# EAGLE design Top (EAGLE 9.6.2)
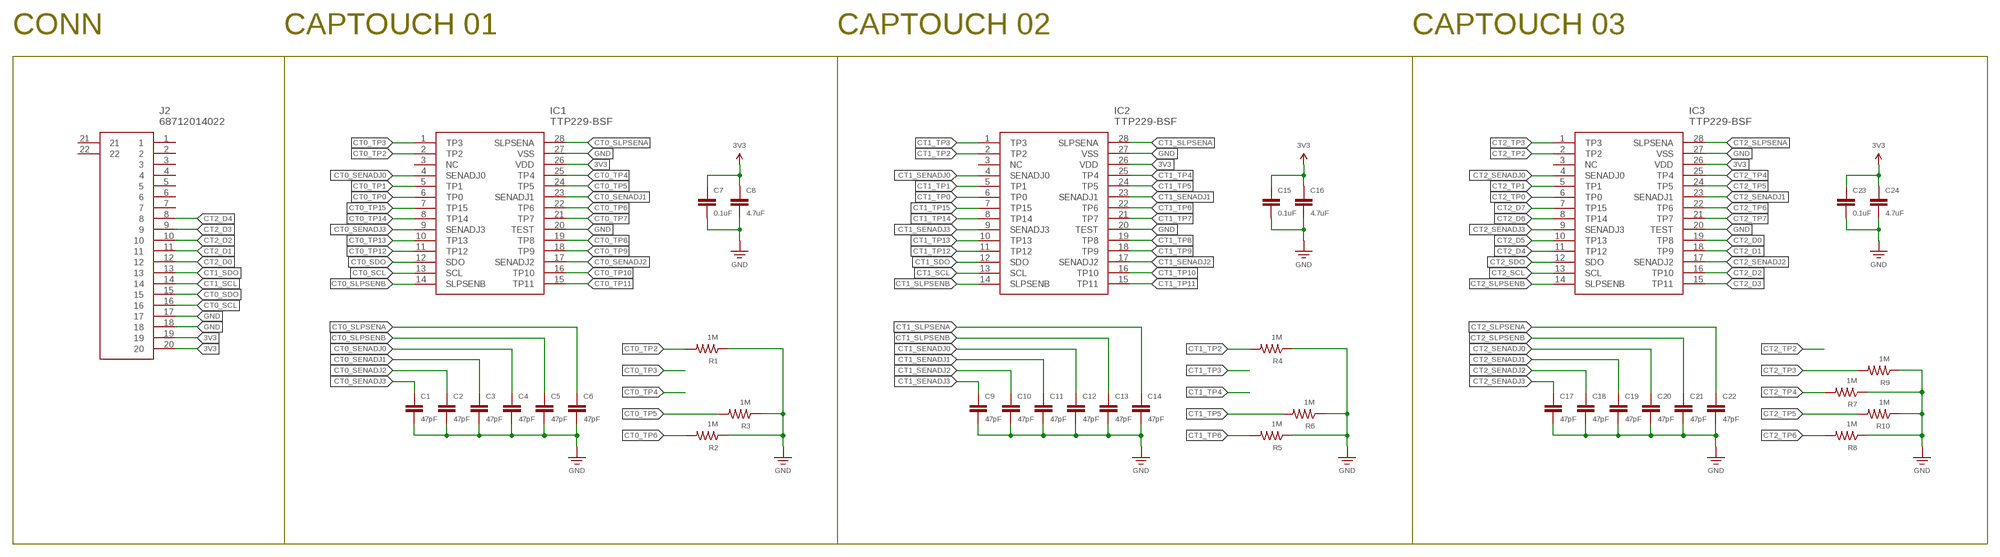
[diagram p0: schematic, sheet 1]

## Parts
C1  47pF  CAP-0603  [CAP-0603]
C2  47pF  CAP-0603  [CAP-0603]
C3  47pF  CAP-0603  [CAP-0603]
C4  47pF  CAP-0603  [CAP-0603]
C5  47pF  CAP-0603  [CAP-0603]
C6  47pF  CAP-0603  [CAP-0603]
C7  0.1uF  CAP-0603  [CAP-0603]
C8  4.7uF  CAP-0603  [CAP-0603]
C9  47pF  CAP-0603  [CAP-0603]
C10  47pF  CAP-0603  [CAP-0603]
C11  47pF  CAP-0603  [CAP-0603]
C12  47pF  CAP-0603  [CAP-0603]
C13  47pF  CAP-0603  [CAP-0603]
C14  47pF  CAP-0603  [CAP-0603]
C15  0.1uF  CAP-0603  [CAP-0603]
C16  4.7uF  CAP-0603  [CAP-0603]
C17  47pF  CAP-0603  [CAP-0603]
C18  47pF  CAP-0603  [CAP-0603]
C19  47pF  CAP-0603  [CAP-0603]
C20  47pF  CAP-0603  [CAP-0603]
C21  47pF  CAP-0603  [CAP-0603]
C22  47pF  CAP-0603  [CAP-0603]
C23  0.1uF  CAP-0603  [CAP-0603]
C24  4.7uF  CAP-0603  [CAP-0603]
IC1  TTP229-BSF  [SOP64P600X175-28N]
IC2  TTP229-BSF  [SOP64P600X175-28N]
IC3  TTP229-BSF  [SOP64P600X175-28N]
J2  68712014022  [68712014022]
R1  1M  RES-0603  [RES-0603]
R2  1M  RES-0603  [RES-0603]
R3  1M  RES-0603  [RES-0603]
R4  1M  RES-0603  [RES-0603]
R5  1M  RES-0603  [RES-0603]
R6  1M  RES-0603  [RES-0603]
R7  1M  RES-0603  [RES-0603]
R8  1M  RES-0603  [RES-0603]
R9  1M  RES-0603  [RES-0603]
R10  1M  RES-0603  [RES-0603]

## Nets
3V3: C7.P$1 C8.P$1 C15.P$1 C16.P$1 C23.P$1 C24.P$1 IC1.26(VDD) IC2.26(VDD) IC3.26(VDD) J2.19 J2.20
CT0_SCL: IC1.13(SCL) J2.16
CT0_SDO: IC1.12(SDO) J2.15
CT0_SENADJ0: C4.P$1 IC1.4(SENADJ0)
CT0_SENADJ1: C3.P$1 IC1.23(SENADJ1)
CT0_SENADJ2: C2.P$1 IC1.17(SENADJ2)
CT0_SENADJ3: C1.P$1 IC1.9(SENADJ3)
CT0_SLPSENA: C6.P$1 IC1.28(SLPSENA)
CT0_SLPSENB: C5.P$1 IC1.14(SLPSENB)
CT0_TP0: IC1.6(TP0)
CT0_TP1: IC1.5(TP1)
CT0_TP2: IC1.2(TP2) R1.P$2
CT0_TP3: IC1.1(TP3)
CT0_TP4: IC1.25(TP4)
CT0_TP5: IC1.24(TP5) R3.P$2
CT0_TP6: IC1.22(TP6) R2.P$2
CT0_TP7: IC1.21(TP7)
CT0_TP8: IC1.19(TP8)
CT0_TP9: IC1.18(TP9)
CT0_TP10: IC1.16(TP10)
CT0_TP11: IC1.15(TP11)
CT0_TP12: IC1.11(TP12)
CT0_TP13: IC1.10(TP13)
CT0_TP14: IC1.8(TP14)
CT0_TP15: IC1.7(TP15)
CT1_SCL: IC2.13(SCL) J2.14
CT1_SDO: IC2.12(SDO) J2.13
CT1_SENADJ0: C12.P$1 IC2.4(SENADJ0)
CT1_SENADJ1: C11.P$1 IC2.23(SENADJ1)
CT1_SENADJ2: C10.P$1 IC2.17(SENADJ2)
CT1_SENADJ3: C9.P$1 IC2.9(SENADJ3)
CT1_SLPSENA: C14.P$1 IC2.28(SLPSENA)
CT1_SLPSENB: C13.P$1 IC2.14(SLPSENB)
CT1_TP0: IC2.6(TP0)
CT1_TP1: IC2.5(TP1)
CT1_TP2: IC2.2(TP2) R4.P$2
CT1_TP3: IC2.1(TP3)
CT1_TP4: IC2.25(TP4)
CT1_TP5: IC2.24(TP5) R6.P$2
CT1_TP6: IC2.22(TP6) R5.P$2
CT1_TP7: IC2.21(TP7)
CT1_TP8: IC2.19(TP8)
CT1_TP9: IC2.18(TP9)
CT1_TP10: IC2.16(TP10)
CT1_TP11: IC2.15(TP11)
CT1_TP12: IC2.11(TP12)
CT1_TP13: IC2.10(TP13)
CT1_TP14: IC2.8(TP14)
CT1_TP15: IC2.7(TP15)
CT2_D0: IC3.19(TP8) J2.12
CT2_D1: IC3.18(TP9) J2.11
CT2_D2: IC3.16(TP10) J2.10
CT2_D3: IC3.15(TP11) J2.9
CT2_D4: IC3.11(TP12) J2.8
CT2_D5: IC3.10(TP13)
CT2_D6: IC3.8(TP14)
CT2_D7: IC3.7(TP15)
CT2_SCL: IC3.13(SCL)
CT2_SDO: IC3.12(SDO)
CT2_SENADJ0: C20.P$1 IC3.4(SENADJ0)
CT2_SENADJ1: C19.P$1 IC3.23(SENADJ1)
CT2_SENADJ2: C18.P$1 IC3.17(SENADJ2)
CT2_SENADJ3: C17.P$1 IC3.9(SENADJ3)
CT2_SLPSENA: C22.P$1 IC3.28(SLPSENA)
CT2_SLPSENB: C21.P$1 IC3.14(SLPSENB)
CT2_TP0: IC3.6(TP0)
CT2_TP1: IC3.5(TP1)
CT2_TP2: IC3.2(TP2)
CT2_TP3: IC3.1(TP3) R9.P$2
CT2_TP4: IC3.25(TP4) R7.P$2
CT2_TP5: IC3.24(TP5) R10.P$2
CT2_TP6: IC3.22(TP6) R8.P$2
CT2_TP7: IC3.21(TP7)
GND: C1.P$2 C2.P$2 C3.P$2 C4.P$2 C5.P$2 C6.P$2 C7.P$2 C8.P$2 C9.P$2 C10.P$2 C11.P$2 C12.P$2 C13.P$2 C14.P$2 C15.P$2 C16.P$2 C17.P$2 C18.P$2 C19.P$2 C20.P$2 C21.P$2 C22.P$2 C23.P$2 C24.P$2 IC1.20(TEST) IC1.27(VSS) IC2.20(TEST) IC2.27(VSS) IC3.20(TEST) IC3.27(VSS) J2.17 J2.18 R1.P$1 R2.P$1 R3.P$1 R4.P$1 R5.P$1 R6.P$1 R7.P$1 R8.P$1 R9.P$1 R10.P$1
Unconnected: IC1.3(NC) IC2.3(NC) IC3.3(NC) J2.1 J2.2 J2.3 J2.4 J2.5 J2.6 J2.7 J2.21 J2.22

## Notes on the sheet
- CONN | CAPTOUCH 01 | CAPTOUCH 02 | CAPTOUCH 03

## Library data of the parts
C1-C24 = Capacitor:CAP-0603
IC1-IC3 = RandomWaves:TTP229-BSF: TOUCH PAD DETECTOR IC Source: Datasheet <http://www.tontek.com.tw/download.asp?sn=726>; DESCRIPTION: TOUCH PAD DETECTOR IC; HEIGHT: 1.75mm; MANUFACTURER_NAME: TONTEK; MANUFACTURER_PART_NUMBER: TTP229-BSF
J2 = RandomWaves:68712014022: Wurth Elektronik 687 Series 0.5mm 20 Way 1 Row Straight PCB Socket Surface Mount Wire to Board Source: Datasheet <https://katalog.we-online.de/em/datasheet/6871xx14022.pdf>; DESCRIPTION: Wurth Elektronik 687 Series 0.5mm 20 Way 1 Row Straight PCB Socket Surface Mount Wire to Board; HEIGHT: 2.1mm; MANUFACTURER_NAME: Wurth Elektronik; MANUFACTURER_PART_NUMBER: 68712014022; MOUSER_PART_NUMBER: 710-68712014022; MOUSER_PRICE-STOCK: https://www.mouser.co.uk/ProductDetail/Wurth-Elektronik/68712014022?qs=ZtY9WdtwX57%2F0bEhtjzEjA%3D%3D
R1-R10 = Resistor:RES-0603

## Board
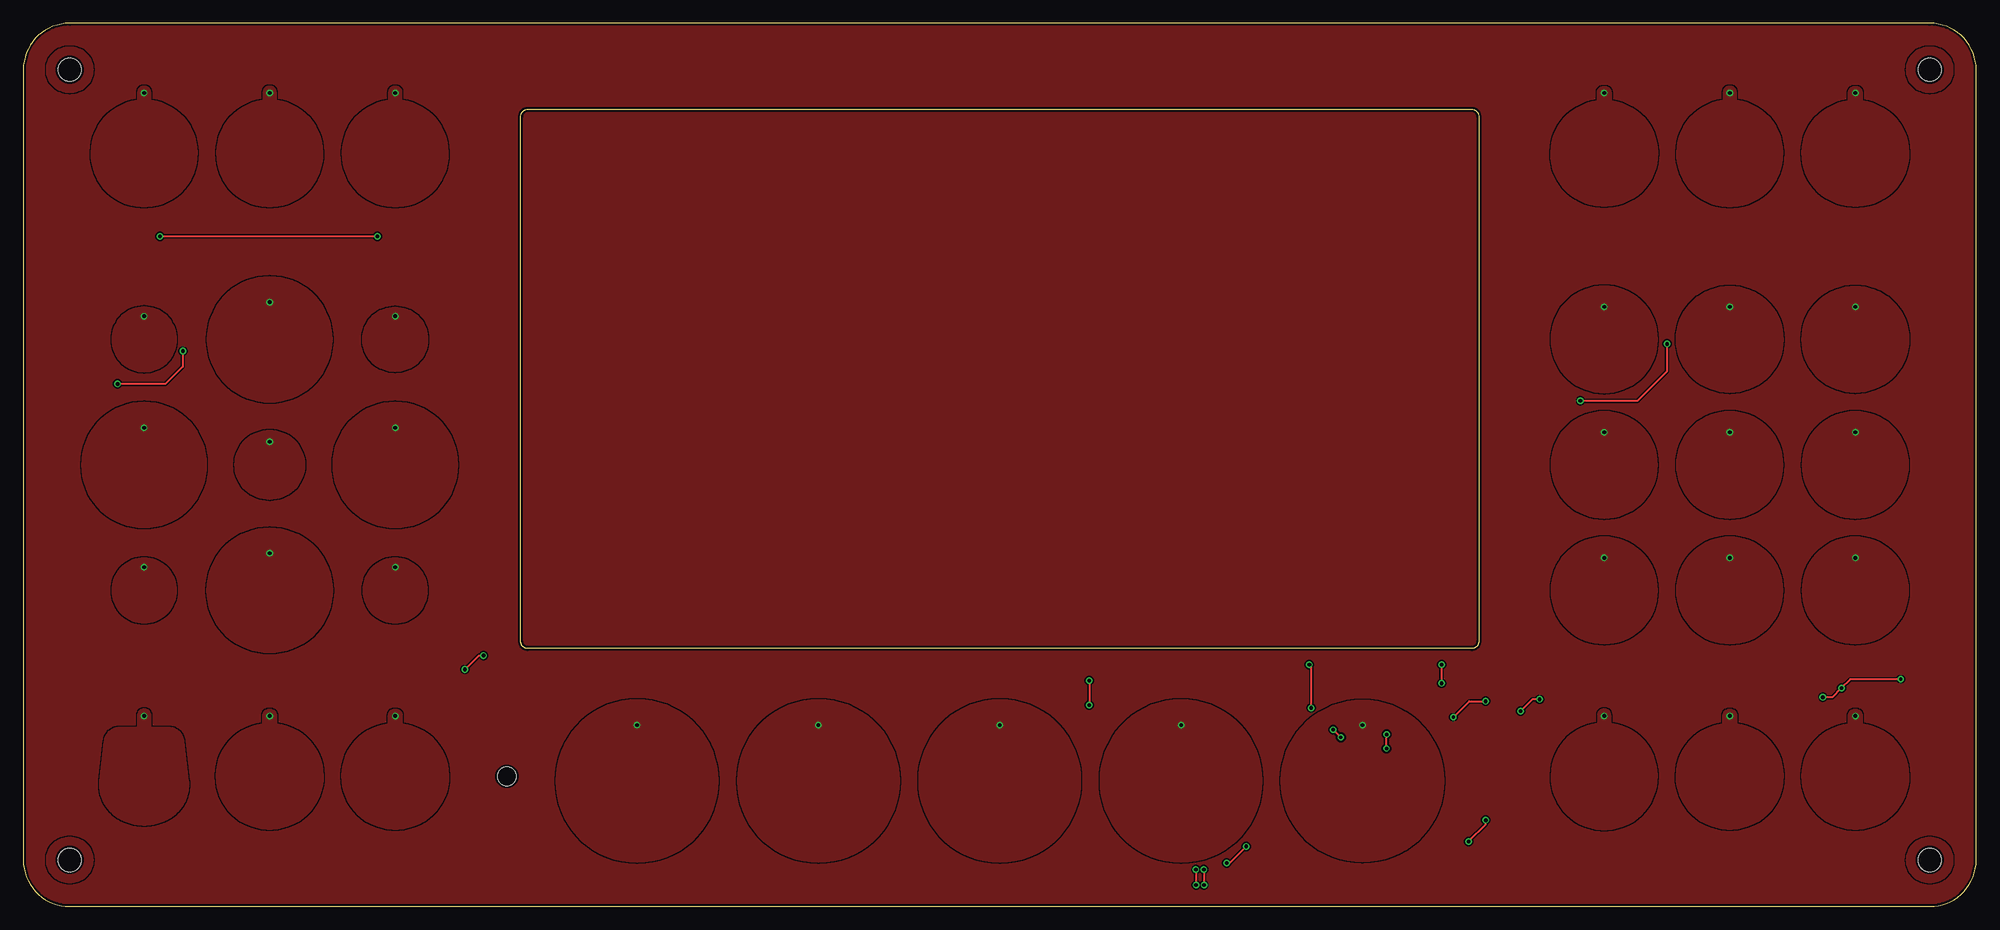
[diagram p1: board, top side]
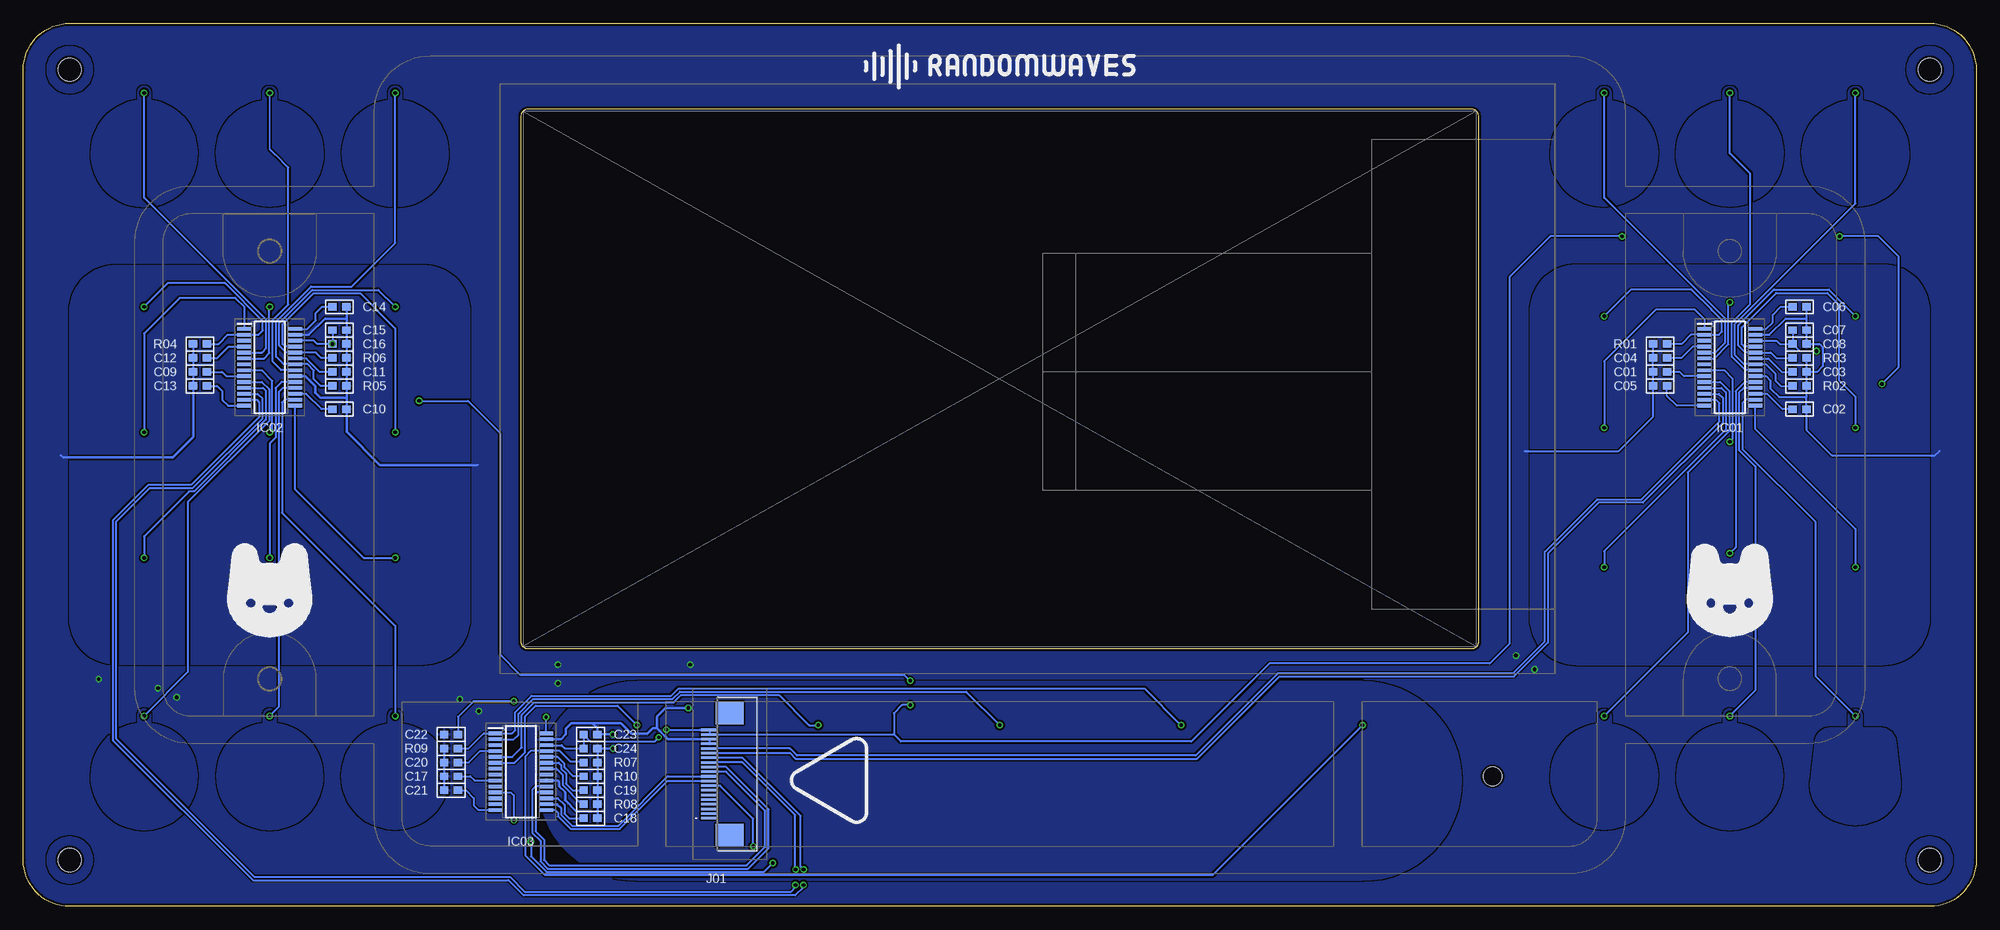
[diagram p2: board, bottom side, seen from below]

Size 210 x 95 mm. Coordinates in mm from the lower left corner, seen from the top.
Outline: 0,90 0,5 arc90 5,0 205,0 arc90 210,5 210,90 arc90 205,95 5,95 arc90 0,90
Outline: 54.25,85.75 155.75,85.75 arc-90 156.5,85 156.5,28.5 arc-90 155.75,27.75 54.25,27.75 arc-90 53.5,28.5 53.5,85 arc-90 54.25,85.75
Copper layers (1*16): Top 0.035mm / dielectric 1.5mm / Bottom 0.035mm
Design rules "ITEADstudio_DRC": minimum track width 6mil, minimum drill 12mil, track to track 6mil, track to pad 6mil, pad to pad 6mil, via to via 6mil, smd to smd 0mil, copper to edge 10mil, drill to drill 10mil, minimum pad ring 10mil, minimum via ring 6mil, stop-mask expansion 2mil, vias tented up to drill 100mil, thermal gap 10mil
Holes 2.5 mm at 5,90 205,90 205,5 5,5
Holes 2 mm at 52,14

### Footprints (pad centres in the part's own frame; a part is rotated, then mirrored left to right if it is on the bottom)
CAP-0603 = smd 0.9 x 0.8: P$1 -0.75,0; P$2 0.75,0
SOP64P600X175-28N = smd 1.525 x 0.4: 1 -2.712,4.128; 2 -2.712,3.492; 3 -2.712,2.858; 4 -2.712,2.222; 5 -2.712,1.588; 6 -2.712,0.952; 7 -2.712,0.318; 8 -2.712,-0.318; 9 -2.712,-0.952; 10 -2.712,-1.588; 11 -2.712,-2.222; 12 -2.712,-2.858; 13 -2.712,-3.492; 14 -2.712,-4.128; 15 2.712,-4.128; 16 2.712,-3.492; 17 2.712,-2.858; 18 2.712,-2.222; 19 2.712,-1.588; 20 2.712,-0.952; 21 2.712,-0.318; 22 2.712,0.318; 23 2.712,0.952; 24 2.712,1.588; 25 2.712,2.222; 26 2.712,2.858; 27 2.712,3.492; 28 2.712,4.128
68712014022 = smd 0.275 x 1.8: 1 -4.75,2.72; 2 -4.25,2.72; 3 -3.75,2.72; 4 -3.25,2.72; 5 -2.75,2.72; 6 -2.25,2.72; 7 -1.75,2.72; 8 -1.25,2.72; 9 -0.75,2.72; 10 -0.25,2.72; 11 0.25,2.72; 12 0.75,2.72; 13 1.25,2.72; 14 1.75,2.72; 15 2.25,2.72; 16 2.75,2.72; 17 3.25,2.72; 18 3.75,2.72; 19 4.25,2.72; 20 4.75,2.72 | smd 2.5 x 3: 21 -6.58,0.56; 22 6.58,0.56
RES-0603 = smd 0.9 x 0.8: P$1 -0.75,0; P$2 0.75,0

### Placement (x,y rotation side)
C1  34,57.5 180 bottom
C2  19,53.5 0 bottom
C3  19,57.5 0 bottom
C4  34,59 180 bottom
C5  34,56 180 bottom
C6  19,64.5 0 bottom
C7  19,62 0 bottom
C8  19,60.5 0 bottom
C9  191,57.5 180 bottom
C10  176,53.5 0 bottom
C11  176,57.5 0 bottom
C12  191,59 180 bottom
C13  191,56 180 bottom
C14  176,64.5 0 bottom
C15  176,62 0 bottom
C16  176,60.5 0 bottom
C17  164,14 180 bottom
C18  149,9.5 0 bottom
C19  149,12.5 0 bottom
C20  164,15.5 180 bottom
C21  164,12.5 180 bottom
C22  164,18.5 180 bottom
C23  149,18.5 0 bottom
C24  149,17 0 bottom
IC1  26.5,58 0 bottom
IC2  183.5,58 0 bottom
IC3  156.5,14.5 0 bottom
J2  133.5,14.25 90 bottom
R1  34,60.5 0 bottom
R2  19,56 180 bottom
R3  19,59 180 bottom
R4  191,60.5 0 bottom
R5  176,56 180 bottom
R6  176,59 180 bottom
R7  149,15.5 180 bottom
R8  149,11 180 bottom
R9  164,17 0 bottom
R10  149,14 180 bottom

### Tracks (layer width: path | path; a pad name or v marks a point on that pad's centre or on a via)
3V3  (via drill 0.35, 0.4)
  Top 0.2: v114.63,24.28 v114.63,21.66 | C16.P$1 176.75,57.55 173.58,54.38 v167.43,54.38 | v17.16,59.74 17.16,58.07 15.29,56.2 v10.15,56.2 | v14.71,72.09 v38.07,72.09 | v141.67,18.19 v140.85,19 v140.85,19.02
  Bottom 0.2: C7.P$1 C8.P$1 | C15.P$1 C16.P$1 178.41,60.5 178.77,60.86 IC2.26 | v114.63,24.28 115.28,24.93 156.55,24.93 158.74,27.12 158.74,50.95 162.17,54.38 v167.43,54.38 | C8.P$1 21.12,60.5 21.48,60.86 IC1.26 | C8.P$1 19,59.75 v17.17,59.75 v17.16,59.74 | IC3.26 152.1,17.36 151.74,17 C24.P$1 C23.P$1 149.03,17.78 142.08,17.78 v141.67,18.19 | v10.15,56.2 8.34,58.01 8.34,69.92 10.51,72.09 v14.71,72.09 | v38.07,72.09 45.78,72.09 50.18,67.69 50.18,28.27 52.31,26.14 76.02,26.14 84.41,17.75 115.63,17.75 116.38,18.5 | 116.38,18.5 J2.19 J2.20 137.24,19.02 v140.85,19.02 | v114.63,21.66 115.5,21.66 116.38,20.78 116.38,18.5
  other vias: 176.75,60.5
CT0_SCL
  Bottom 0.2: IC1.13 27.98,54.51 27.62,54.15 27.62,52.16 35.99,43.8 40.75,43.8 46.41,38.14 46.41,28.53 49.85,25.09 75.09,25.09 83.93,16.25 126.8,16.25 127.55,17 J2.16
CT0_SDO
  Bottom 0.2: IC1.12 27.67,55.14 27.27,54.74 27.27,52.02 35.84,43.45 40.6,43.45 46.06,37.99 46.06,28.38 49.71,24.74 74.94,24.74 83.78,15.9 126.95,15.9 127.55,16.5 J2.15
CT0_SENADJ0
  Bottom 0.2: IC1.4 30.49,60.22 31.71,59 C4.P$1
CT0_SENADJ1
  Bottom 0.2: IC1.23 22.36,58.95 20.91,57.5 C3.P$1
CT0_SENADJ2
  Bottom 0.2: C2.P$1 20.85,53.5 22.49,55.14 IC1.17
CT0_SENADJ3
  Bottom 0.2: IC1.9 31.43,57.05 31.88,57.5 C1.P$1
CT0_SLPSENA
  Bottom 0.2: IC1.28 22.6,62.13 21.9,62.83 21.9,63.62 21.02,64.5 C6.P$1
CT0_SLPSENB
  Bottom 0.2: IC1.14 32.2,53.87 33.25,54.92 C5.P$1
CT0_TP0  (via drill 0.4)
  Bottom 0.2: IC1.6 28.17,58.95 26.64,60.48 26.64,64.86 v26.5,65
  pour Top (isolate 0.2): 26.5,67.75 arc90 19.75,61 arc90 26.5,54.25 arc90 33.25,61 arc90
CT0_TP1  (via drill 0.4)
  Bottom 0.2: IC1.5 28.03,59.59 26.99,60.63 26.99,63.23 40,76.24 v40,87.5
  pour Top (isolate 0.2): 39.25,87.5 39.25,86.7 arc345 40.75,86.7 40.75,87.5 arc180
CT0_TP2  (via drill 0.4)
  Bottom 0.2: R1.P$2 31.67,60.5 30.68,61.49 IC1.2 27.67,61.49 27.34,61.82 27.34,63.08 28.38,64.12 28.51,64.25 30.62,66.36 37.14,66.36 v40,63.5
  pour Top (isolate 0.2): 40,57.5 arc-90 36.5,61 arc-90 40,64.5 arc-90 43.5,61 arc-90
CT0_TP3  (via drill 0.4)
  Bottom 0.2: IC1.1 29.21,63.15 30.24,64.18 34.48,64.18 40,58.66 v40,51.5
  pour Top (isolate 0.2): 40,54.25 arc90 33.25,47.5 arc90 40,40.75 arc90 46.75,47.5 arc90
CT0_TP4  (via drill 0.4)
  Bottom 0.2: IC1.25 24.96,60.22 25.23,60.49 25.23,62.28 21.51,66 16,66 14.76,64.76 14.76,56.63 13,54.87 v13,51.5
  pour Top (isolate 0.2): 13,54.25 arc90 6.25,47.5 arc90 13,40.75 arc90 19.75,47.5 arc90
CT0_TP5  (via drill 0.4)
  Bottom 0.2: R3.P$2 21.51,59 22.1,59.59 IC1.24 24.83,59.59 25.58,60.34 25.58,62.52 21.75,66.35 15.85,66.35 v13,63.5
  pour Top (isolate 0.2): 13,64.5 arc90 9.5,61 arc90 13,57.5 arc90 16.5,61 arc90
CT0_TP6  (via drill 0.4)
  Bottom 0.2: R2.P$2 21.04,56 21.6,56.56 21.6,57.31 22.61,58.32 IC1.22 24.97,58.32 25.94,59.28 25.94,62.66 13,75.6 v13,87.5
  pour Top (isolate 0.2): 12.25,87.5 12.25,86.7 arc345 13.75,86.7 13.75,87.5 arc180
CT0_TP7  (via drill 0.4)
  Bottom 0.2: IC1.21 24.83,57.68 26.29,59.14 26.29,62.81 24.32,64.78 24.32,78.82 26.5,81 v26.5,87.5
  pour Top (isolate 0.2): 25.75,87.5 25.75,86.7 arc345 27.25,86.7 27.25,87.5 arc180
CT0_TP8  (via drill 0.4)
  Bottom 0.2: IC1.19 24.87,56.41 25.86,55.42 25.86,38.64 v26.5,38
  pour Top (isolate 0.2): 26.5,27.25 arc-90 19.75,34 arc-90 26.5,40.75 arc-90 33.25,34 arc-90
CT0_TP9  (via drill 0.4)
  Bottom 0.2: IC1.18 25,55.78 25.51,55.27 25.51,49.11 23.74,47.34 23.74,23.26 v26.5,20.5
  pour Top (isolate 0.2): 27.25,19.7 arc-345 25.75,19.7 25.75,20.5 arc-180 27.25,20.5
CT0_TP10  (via drill 0.4)
  Bottom 0.2: IC1.16 24.75,54.51 25.13,54.13 25.13,49.23 17.3,41.4 17.3,24.8 v13,20.5
  pour Top (isolate 0.2): 8.17,13.16 8.17,13.08 8.17,12.99 8.17,12.9 8.18,12.82 8.18,12.73 8.19,12.64 8.2,12.56 8.22,12.44 8.24,12.35 8.26,12.26 8.28,12.16 8.3,12.07 8.32,11.99 8.35,11.9 8.38,11.81 8.41,11.72 8.45,11.63 8.48,11.55 8.52,11.47 8.55,11.39 8.59,11.31 8.63,11.23 8.68,11.15 8.72,11.07 8.76,11 8.81,10.92 8.86,10.85 8.91,10.77 8.96,10.7 9.01,10.63 9.07,10.56 9.12,10.49 9.18,10.43 9.24,10.36 9.3,10.29 9.36,10.23 9.42,10.17 9.49,10.11 9.55,10.05 9.62,9.99 9.68,9.93 9.75,9.87 9.82,9.82 9.89,9.77 9.96,9.71 10.03,9.66 10.11,9.61 10.18,9.56 10.25,9.52 10.33,9.47 10.4,9.43 10.48,9.39 10.56,9.34 10.64,9.3 10.79,9.23 10.95,9.16 11.12,9.09 11.28,9.03 11.45,8.98 11.62,8.93 11.79,8.89 11.96,8.85 12.13,8.82 12.3,8.8 12.48,8.78 12.65,8.76 12.83,8.75 13,8.75 13.17,8.75 13.35,8.76 13.52,8.78 13.7,8.8 13.87,8.82 14.04,8.85 14.21,8.89 14.38,8.93 14.55,8.98 14.72,9.03 14.88,9.09 15.05,9.16 15.21,9.23 15.36,9.3 15.44,9.34 15.52,9.39 15.6,9.43 15.67,9.47 15.75,9.52 15.82,9.56 15.89,9.61 15.97,9.66 16.04,9.71 16.11,9.77 16.18,9.82 16.25,9.87 16.32,9.93 16.38,9.99 16.45,10.05 16.51,10.11 16.58,10.17 16.64,10.23 16.7,10.3 16.76,10.36 16.82,10.43 16.88,10.49 16.93,10.56 16.99,10.63 17.04,10.7 17.09,10.77 17.14,10.85 17.19,10.92 17.24,11 17.28,11.07 17.33,11.15 17.37,11.23 17.41,11.31 17.45,11.39 17.48,11.47 17.52,11.55 17.56,11.63 17.59,11.72 17.62,11.81 17.65,11.9 17.68,11.99 17.7,12.08 17.72,12.17 17.74,12.26 17.77,12.37 17.79,12.49 17.8,12.61 17.82,12.73 17.82,12.82 17.83,12.9 17.83,12.99 17.83,13.08 17.83,13.16 17.83,13.24 17.82,13.32 17.82,13.41 17.81,13.45 17.33,17.74 arc85 15.67,19.25 13.75,19.25 13.75,20.5 arc180 12.25,20.5 12.25,19.25 10.33,19.25 arc85 8.67,17.74 8.19,13.45 8.18,13.4 8.17,13.32 8.17,13.24
CT0_TP11  (via drill 0.4)
  Bottom 0.2: IC1.15 23.79,51.4 13,40.61 v13,36.5
  pour Top (isolate 0.2): 13,37.5 arc90 9.5,34 arc90 13,30.5 arc90 16.5,34 arc90
CT0_TP12  (via drill 0.4)
  Bottom 0.2: IC1.11 27.4,55.78 26.92,55.3 26.92,51.3 40,38.22 v40,36.5
  pour Top (isolate 0.2): 40,37.5 arc90 36.5,34 arc90 40,30.5 arc90 43.5,34 arc90
CT0_TP13  (via drill 0.4)
  Bottom 0.2: IC1.10 27.53,56.41 26.57,55.45 26.57,51.15 31.03,46.69 31.03,29.47 v40,20.5
  pour Top (isolate 0.2): 40.75,19.7 arc-345 39.25,19.7 39.25,20.5 arc-180 40.75,20.5
CT0_TP14  (via drill 0.4)
  Bottom 0.2: IC1.8 27.11,57.68 26.22,56.78 26.22,50.28 v26.5,50
  pour Top (isolate 0.2): 26.5,43.75 arc-90 22.75,47.5 arc-90 26.5,51.25 arc-90 30.25,47.5 arc-90
CT1_SCL  (via drill 0.4)
  Top 0.2: v126.09,3.97 v126.09,2.31 v126.1,2.3
  Bottom 0.2: IC2.13 184.93,54.51 184.63,54.21 184.63,52.65 191.93,45.35 196.55,45.35 200.36,41.54 200.36,17.89 185.3,2.83 157.82,2.83 156.18,1.19 126.98,1.19 126.1,2.07 v126.1,2.3 | v126.09,3.97 126.34,4.22 126.34,4.23 126.39,4.28 126.39,9.73 132.66,16 J2.14
CT1_SDO  (via drill 0.4)
  Top 0.2: v126.95,3.98 v126.96,3.97 v126.96,2.31
  Bottom 0.2: IC2.12 184.79,55.14 184.27,54.62 184.27,52.51 191.78,45 196.4,45 200.01,41.39 200.01,18.04 185.15,3.18 157.67,3.18 156.03,1.54 127.52,1.54 126.96,2.1 v126.96,2.31 | v126.95,3.98 127,4.03 127,9.84 132.33,15.17 132.66,15.5 J2.13
CT1_SENADJ0
  Bottom 0.2: C12.P$1 189.12,59 187.9,60.22 IC2.4
CT1_SENADJ1
  Bottom 0.2: C11.P$1 178.1,57.5 179.55,58.95 IC2.23
CT1_SENADJ2
  Bottom 0.2: C10.P$1 177.92,53.5 179.56,55.14 IC2.17
CT1_SENADJ3
  Bottom 0.2: C9.P$1 188.62,57.5 188.17,57.05 IC2.9
CT1_SLPSENA
  Bottom 0.2: IC2.28 179.45,62.13 178.55,63.03 178.55,63.83 177.88,64.5 C14.P$1
CT1_SLPSENB
  Bottom 0.2: C13.P$1 189.15,56 188.59,55.44 188.59,54.48 187.98,53.87 IC2.14
CT1_TP0  (via drill 0.4)
  Bottom 0.2: IC2.6 184.12,58.95 183.53,59.54 183.53,64.47 v183.5,64.5
  pour Top (isolate 0.2): 183.5,55.25 arc-90 177.75,61 arc-90 183.5,66.75 arc-90 189.25,61 arc-90
CT1_TP1  (via drill 0.4)
  Bottom 0.2: IC2.5 184.33,59.59 183.88,60.04 183.88,63.12 197,76.24 v197,87.5
  pour Top (isolate 0.2): 197.75,86.7 arc-345 196.25,86.7 196.25,87.5 arc-180 197.75,87.5
CT1_TP2  (via drill 0.4)
  Bottom 0.2: R4.P$2 189,60.5 188.01,61.49 IC2.2 184.69,61.49 184.23,61.95 184.23,62.98 188.29,67.03 194.47,67.03 v197,64.5
  pour Top (isolate 0.2): 197,55.25 arc-90 191.25,61 arc-90 197,66.75 arc-90 202.75,61 arc-90
CT1_TP3  (via drill 0.4)
  Bottom 0.2: IC2.1 186.21,63.5 186.21,63.84 186.21,64.45 187.2,65.44 193.2,65.44 197,61.64 v197,51
  pour Top (isolate 0.2): 197,53.25 arc90 191.25,47.5 arc90 197,41.75 arc90 202.75,47.5 arc90
CT1_TP4  (via drill 0.4)
  Bottom 0.2: IC2.25 181.86,60.22 182.12,60.48 182.12,62.62 178.77,65.97 173.8,65.97 170,62.17 v170,51
  pour Top (isolate 0.2): 170,53.25 arc90 164.25,47.5 arc90 170,41.75 arc90 175.75,47.5 arc90
CT1_TP5  (via drill 0.4)
  Bottom 0.2: R6.P$2 177.95,59 178.54,59.59 IC2.24 181.73,59.59 182.47,60.33 182.47,62.77 178.92,66.32 171.82,66.32 v170,64.5
  pour Top (isolate 0.2): 170,66.75 arc90 164.25,61 arc90 170,55.25 arc90 175.75,61 arc90
CT1_TP6  (via drill 0.4)
  Bottom 0.2: R5.P$2 178.02,56 178.77,56.75 178.77,57.67 179.42,58.32 IC2.22 182.02,58.32 182.82,59.12 182.82,62.91 179.06,66.67 174.69,66.67 170,71.36 v170,87.5
  pour Top (isolate 0.2): 170.75,86.7 arc-345 169.25,86.7 169.25,87.5 arc-180 170.75,87.5
CT1_TP7  (via drill 0.4)
  Bottom 0.152: 181.49,79.49 182.87,80.87 182.89,80.87 183.5,81.48 v183.5,87.5
  Bottom 0.2: IC2.21 182.27,57.68 183.18,58.59 183.18,63.06 181.49,64.75 181.49,79.49
  pour Top (isolate 0.2): 182.75,87.5 182.75,86.7 arc345 184.25,86.7 184.25,87.5 arc180
CT1_TP8  (via drill 0.4)
  Bottom 0.2: IC2.19 182.22,56.41 182.87,55.77 182.87,50.42 183.5,49.79 v183.5,37.5
  pour Top (isolate 0.2): 183.5,39.75 arc90 177.75,34 arc90 183.5,28.25 arc90 189.25,34 arc90
CT1_TP9  (via drill 0.4)
  Bottom 0.2: IC2.18 182.08,55.78 182.51,55.35 182.51,21.49 v183.5,20.5
  pour Top (isolate 0.2): 184.25,19.7 arc-345 182.75,19.7 182.75,20.5 arc-180 184.25,20.5
CT1_TP10  (via drill 0.4)
  Bottom 0.2: IC2.16 181.87,54.51 182.16,54.22 182.16,42.35 170,30.19 v170,20.5
  pour Top (isolate 0.2): 169.25,20.5 169.25,19.7 arc345 170.75,19.7 170.75,20.5 arc180
CT1_TP11  (via drill 0.4)
  Bottom 0.2: v170,37.5 173.4,37.5 180.79,44.89 IC2.15
  pour Top (isolate 0.2): 170,39.75 arc90 164.25,34 arc90 170,28.25 arc90 175.75,34 arc90
CT1_TP12  (via drill 0.4)
  Bottom 0.2: IC2.11 184.21,55.78 183.92,55.49 183.92,52.36 191.64,44.65 192.18,44.65 197,39.83 v197,37.5
  pour Top (isolate 0.2): 197,39.75 arc90 191.25,34 arc90 197,28.25 arc90 202.75,34 arc90
CT1_TP13  (via drill 0.4)
  Bottom 0.2: IC2.10 184.34,56.41 183.57,55.64 183.57,52.22 192.29,43.49 192.29,25.21 v197,20.5
  pour Top (isolate 0.2): 197.75,19.7 arc-345 196.25,19.7 196.25,20.5 arc-180 197.75,20.5
CT1_TP14  (via drill 0.4)
  Bottom 0.2: IC2.8 184.36,57.68 183.22,56.54 183.22,51.28 v183.5,51
  pour Top (isolate 0.2): 183.5,53.25 arc90 177.75,47.5 arc90 183.5,41.75 arc90 189.25,47.5 arc90
CT2_D0
  Bottom 0.2: IC3.19 154.89,12.91 155.27,12.53 155.27,7.95 154.37,7.05 154.37,4.85 153.59,4.07 132.05,4.07 129.86,6.26 129.86,10.45 134.41,15 J2.12
CT2_D1
  Bottom 0.2: IC3.18 154.74,12.28 154.92,12.1 154.92,8.1 154.02,7.2 154.02,5 153.44,4.42 132.2,4.42 130.21,6.41 130.21,10.3 134.41,14.5 J2.11
CT2_D2
  Bottom 0.2: IC3.16 152.57,11.01 152.15,10.59 152.15,9.84 151,8.69 146.01,8.69 140.7,14 J2.10
CT2_D3
  Bottom 0.2: IC3.15 152.79,10.37 152.5,10.09 152.5,9.7 151.14,8.34 145.86,8.34 140.7,13.5 J2.9
CT2_D4  (via drill 0.4)
  Top 0.2: v131.51,6.46 129.73,4.68 v129.4,4.68 | v155.42,6.99 157.26,8.83 v157.26,9.28
  Bottom 0.2: IC3.11 157.58,12.28 157.26,11.96 v157.26,9.28 | v131.51,6.46 131.51,9.44 135.07,13 J2.8 | v129.4,4.68 130.37,3.72 153.74,3.72 155.42,5.39 v155.42,6.99
CT2_SENADJ0
  Bottom 0.2: C20.P$1 162.09,15.5 160.87,16.72 IC3.4
CT2_SENADJ1
  Bottom 0.2: IC3.23 152.43,15.45 152.16,15.18 152.16,14.81 151.65,14.3 151.65,13.21 150.94,12.5 C19.P$1
CT2_SENADJ2
  Bottom 0.2: IC3.17 152.53,11.64 151.8,10.91 151.8,9.99 151.31,9.5 C18.P$1
CT2_SENADJ3
  Bottom 0.2: C17.P$1 161.93,14 161.48,13.55 IC3.9
CT2_SLPSENA  (via drill 0.35, 0.4)
  Top 0.2: v157.25,22.07 155.49,22.07 v153.79,20.37
  Bottom 0.2: IC3.28 v153.79,20.37 | v157.25,22.07 161.59,22.07 163.25,20.41 C22.P$1
CT2_SLPSENB
  Bottom 0.2: C21.P$1 162.39,12.5 161.55,11.66 161.55,10.86 161.06,10.37 IC3.14
CT2_TP0  (via drill 0.4)
  Bottom 0.2: IC3.6 157.19,15.45 156.05,16.59 156.05,20.45 154.9,21.6 146.1,21.6 v144,19.5
  pour Top (isolate 0.2): 144,4.75 arc-90 135.25,13.5 arc-90 144,22.25 arc-90 152.75,13.5 arc-90
CT2_TP1  (via drill 0.4)
  Bottom 0.2: IC3.5 157.42,16.09 156.41,17.1 156.41,20.59 155.05,21.95 140.05,21.95 139.25,22.75 128.75,22.75 125.5,19.5 v124.5,19.5
  pour Top (isolate 0.2): 124.5,22.25 arc90 115.75,13.5 arc90 124.5,4.75 arc90 133.25,13.5 arc90
CT2_TP2  (via drill 0.4)
  Bottom 0.2: IC3.2 157.25,17.99 156.76,18.48 156.76,20.74 155.19,22.3 140.19,22.3 139.4,23.1 108.6,23.1 v105,19.5
  pour Top (isolate 0.2): 105,22.25 arc90 96.25,13.5 arc90 105,4.75 arc90 113.75,13.5 arc90
CT2_TP3  (via drill 0.4)
  Bottom 0.2: R9.P$2 162.11,17 160.48,18.63 IC3.1 157.45,18.63 157.11,18.97 157.11,20.89 155.34,22.66 140.34,22.66 139.54,23.45 89.45,23.45 v85.5,19.5
  pour Top (isolate 0.2): 85.5,22.25 arc90 76.75,13.5 arc90 85.5,4.75 arc90 94.25,13.5 arc90
CT2_TP4  (via drill 0.4)
  Bottom 0.2: R7.P$2 149.82,15.57 151.16,15.57 152.31,16.72 IC3.25 155.42,16.72 156.02,16.12 156.02,5.5 153.88,3.36 82.14,3.36 v66,19.5
  pour Top (isolate 0.2): 66,22.25 arc90 57.25,13.5 arc90 66,4.75 arc90 74.75,13.5 arc90
CT2_TP5
  Bottom 0.2: R10.P$2 150.85,14 151.81,14.96 151.81,15.33 152.57,16.09 IC3.24
CT2_TP6
  Bottom 0.2: IC3.22 152.66,14.82 152,14.16 152,13.06 149.94,11 R8.P$2
GND  (via drill 0.35, 0.4)
  Top 0.2: v47.5,25.5 49,27 v49.5,27 | v193.5,22.5 194.5,22.5 v195.5,23.5 196.45,24.45 v201.88,24.45 | v138.49,21.36 138.49,25.81 v138.29,26.01 | v163.04,22.28 162.28,22.28 v161,21 | v152.5,26 v152.5,24 | v146.59,16.99 v146.59,18.49 v146.6,18.5
  Bottom 0.2: R3.P$1 C3.P$2 | C3.P$2 R2.P$1 18.25,54.77 | IC1.20 22.58,57.05 22.12,56.59 22.12,55.7 21.19,54.77 18.25,54.77 | C6.P$2 18.25,63.24 | 18.25,63.24 C7.P$2 C8.P$2 16.84,60.5 16.49,60.15 16.49,58.12 17.11,57.5 C3.P$2 | 18.25,63.24 20.5,63.24 22.25,61.49 IC1.27 | R1.P$1 C4.P$2 C1.P$2 C5.P$2 34.75,52.67 38.46,48.96 48.55,48.96 | 175.25,54.75 R5.P$1 C11.P$2 R6.P$1 C16.P$2 C15.P$2 175.25,63.26 | 175.25,54.75 C10.P$2 175.25,51.07 171.68,47.5 161.12,47.5 | C14.P$2 175.25,63.26 | R4.P$1 C12.P$2 C9.P$2 C13.P$2 191.75,50.47 193.94,48.28 205.7,48.28 205.98,48.56 | IC2.20 179.68,57.05 178.62,55.99 178.62,55.27 178.1,54.75 175.25,54.75 | IC2.27 179.29,61.49 177.52,63.26 175.25,63.26 | 3.95,49 4.44,48.51 15.53,48.51 18.25,51.23 C2.P$2 18.25,54.77 | 148.79,19.69 151.11,19.69 151.68,19.12 151.68,18.49 152.18,17.99 IC3.27 | 148.79,19.69 148.25,19.15 C23.P$2 v146.6,18.5 | 148.25,10.25 R8.P$1 C19.P$2 R10.P$1 R7.P$1 C24.P$2 v146.6,17 v146.59,16.99 | 148.25,10.25 C18.P$2 | IC3.20 152.55,13.55 152.35,13.35 152.35,12.92 151.76,12.32 151.76,11.47 150.54,10.25 148.25,10.25 | J2.17 J2.18 140.66,18 141.84,19.18 | R9.P$1 C20.P$2 C17.P$2 C21.P$2 | 141.84,19.18 141.84,20.43 140.91,21.36 v138.49,21.36 | 141.84,19.18 142.32,19.18 142.91,18.59 144.61,18.59 145.71,19.69 148.79,19.69
  pour Bottom (rank 2): 0,90 0,5 arc90 5,0 205,0 arc90 210,5 210,90 arc90 205,95 5,95 arc90
N$1
  pour Bottom (isolate 0.2): 162,64 162,31 arc90 167,26 200,26 arc90 205,31 205,64 arc90 200,69 167,69 arc90
N$2
  pour Bottom: 10,26 arc-90 5,31 5,64 arc-90 10,69 arc0 43,69 arc-90 48,64 48,31 arc-90 43,26
N$3
  pour Bottom (isolate 0.2): 197.75,19.7 arc-345 196.25,19.7 196.25,20.5 arc-180 197.75,20.5
N$4
  pour Bottom (isolate 0.2): 169.25,20.5 169.25,19.7 arc345 170.75,19.7 170.75,20.5 arc180
N$5
  pour Bottom (isolate 0.2): 184.25,19.7 arc-345 182.75,19.7 182.75,20.5 arc-180 184.25,20.5
N$6
  pour Bottom (isolate 0.2): 197.75,86.7 arc-345 196.25,86.7 196.25,87.5 arc-180 197.75,87.5
N$7
  pour Bottom (isolate 0.2): 144,2.8 66,2.8 arc-180 66,24.2 144,24.2 arc-180
N$8
  pour Bottom (isolate 0.2): 170.75,86.7 arc-345 169.25,86.7 169.25,87.5 arc-180 170.75,87.5
N$9
  pour Bottom (isolate 0.2): 182.75,87.5 182.75,86.7 arc345 184.25,86.7 184.25,87.5 arc180
N$10
  pour Bottom (isolate 0.2): 12.25,87.5 12.25,86.7 arc345 13.75,86.7 13.75,87.5 arc180
N$11
  pour Bottom (isolate 0.2): 39.25,87.5 39.25,86.7 arc345 40.75,86.7 40.75,87.5 arc180
N$12
  pour Bottom (isolate 0.2): 25.75,87.5 25.75,86.7 arc345 27.25,86.7 27.25,87.5 arc180
N$13
  pour Bottom (isolate 0.2): 39.25,20.5 39.25,19.7 arc345 40.75,19.7 40.75,20.5 arc180
N$14
  pour Bottom (isolate 0.2): 27.25,19.7 arc-345 25.75,19.7 25.75,20.5 arc-180 27.25,20.5
N$15
  pour Bottom (isolate 0.2): 8.17,13.16 8.17,13.08 8.17,12.99 8.17,12.9 8.18,12.82 8.18,12.73 8.19,12.64 8.2,12.56 8.22,12.44 8.24,12.35 8.26,12.26 8.28,12.16 8.3,12.07 8.32,11.99 8.35,11.9 8.38,11.81 8.41,11.72 8.45,11.63 8.48,11.55 8.52,11.47 8.55,11.39 8.59,11.31 8.63,11.23 8.68,11.15 8.72,11.07 8.76,11 8.81,10.92 8.86,10.85 8.91,10.77 8.96,10.7 9.01,10.63 9.07,10.56 9.12,10.49 9.18,10.43 9.24,10.36 9.3,10.29 9.36,10.23 9.42,10.17 9.49,10.11 9.55,10.05 9.62,9.99 9.68,9.93 9.75,9.87 9.82,9.82 9.89,9.77 9.96,9.71 10.03,9.66 10.11,9.61 10.18,9.56 10.25,9.52 10.33,9.47 10.4,9.43 10.48,9.39 10.56,9.34 10.64,9.3 10.79,9.23 10.95,9.16 11.12,9.09 11.28,9.03 11.45,8.98 11.62,8.93 11.79,8.89 11.96,8.85 12.13,8.82 12.3,8.8 12.48,8.78 12.65,8.76 12.83,8.75 13,8.75 13.17,8.75 13.35,8.76 13.52,8.78 13.7,8.8 13.87,8.82 14.04,8.85 14.21,8.89 14.38,8.93 14.55,8.98 14.72,9.03 14.88,9.09 15.05,9.16 15.21,9.23 15.36,9.3 15.44,9.34 15.52,9.39 15.6,9.43 15.67,9.47 15.75,9.52 15.82,9.56 15.89,9.61 15.97,9.66 16.04,9.71 16.11,9.77 16.18,9.82 16.25,9.87 16.32,9.93 16.38,9.99 16.45,10.05 16.51,10.11 16.58,10.17 16.64,10.23 16.7,10.3 16.76,10.36 16.82,10.43 16.88,10.49 16.93,10.56 16.99,10.63 17.04,10.7 17.09,10.77 17.14,10.85 17.19,10.92 17.24,11 17.28,11.07 17.33,11.15 17.37,11.23 17.41,11.31 17.45,11.39 17.48,11.47 17.52,11.55 17.56,11.63 17.59,11.72 17.62,11.81 17.65,11.9 17.68,11.99 17.7,12.08 17.72,12.17 17.74,12.26 17.77,12.37 17.79,12.49 17.8,12.61 17.82,12.73 17.82,12.82 17.83,12.9 17.83,12.99 17.83,13.08 17.83,13.16 17.83,13.24 17.82,13.32 17.82,13.41 17.81,13.45 17.33,17.74 arc85 15.67,19.25 13.75,19.25 13.75,20.5 arc180 12.25,20.5 12.25,19.25 10.33,19.25 arc85 8.67,17.74 8.19,13.45 8.18,13.4 8.17,13.32 8.17,13.24
N$16
  pour Bottom (isolate 0.2): 205,2.5 arc-90 202.5,5 arc-90 205,7.5 arc-90 207.5,5 arc-90
  pour Top (isolate 0.2): 205,2.5 arc-90 202.5,5 arc-90 205,7.5 arc-90 207.5,5 arc-90
N$17
  pour Bottom (isolate 0.2): 205,87.5 arc-90 202.5,90 arc-90 205,92.5 arc-90 207.5,90 arc-90
  pour Top (isolate 0.2): 205,87.5 arc-90 202.5,90 arc-90 205,92.5 arc-90 207.5,90 arc-90
N$18
  pour Bottom (isolate 0.2): 5,2.5 arc-90 2.5,5 arc-90 5,7.5 arc-90 7.5,5 arc-90
  pour Top (isolate 0.2): 5,2.5 arc-90 2.5,5 arc-90 5,7.5 arc-90 7.5,5 arc-90
N$19
  pour Bottom (isolate 0.2): 5,87.5 arc-90 2.5,90 arc-90 5,92.5 arc-90 7.5,90 arc-90
  pour Top (isolate 0.2): 5,87.5 arc-90 2.5,90 arc-90 5,92.5 arc-90 7.5,90 arc-90
N$20
  pour Top (rank 2): 0,90 0,5 arc90 5,0 205,0 arc90 210,5 210,90 arc90 205,95 5,95 arc90

### Text on the board
bPlace: C06 | C14 | C07 | C15 | C08 | R01 | C16 | R04 | R03 | C04 | R06 | C12 | C03 | C01 | C11 | C09 | R02 | C05 | R05 | C13 | C02 | C10 | IC01 | IC02 | C23 | C22 | C24 | R09 | R07 | C20 | R10 | C17 | C19 | C21 | R08 | C18 | IC03 | J01